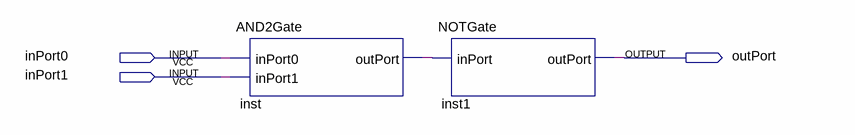
[diagram p0: schematic sheet]
// Quartus schematic NAND2Block.bdf as structural Verilog: 2 symbols, 3 pins
module NAND2Block (
  input  inPort0,
  input  inPort1,
  output outPort
);

  wire inst_outport;

  AND2Gate inst (.inPort0(inPort0), .inPort1(inPort1), .outPort(inst_outport));
  NOTGate inst1 (.inPort(inst_outport), .outPort(outPort));
endmodule
